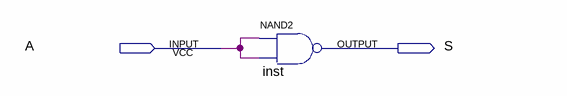
[diagram p0: schematic sheet]
// Quartus schematic nand_not.bdf as structural Verilog: 1 symbols, 2 pins
module nand_not (
  input  A,
  output S
);

  nand inst (S, A, A);
endmodule
